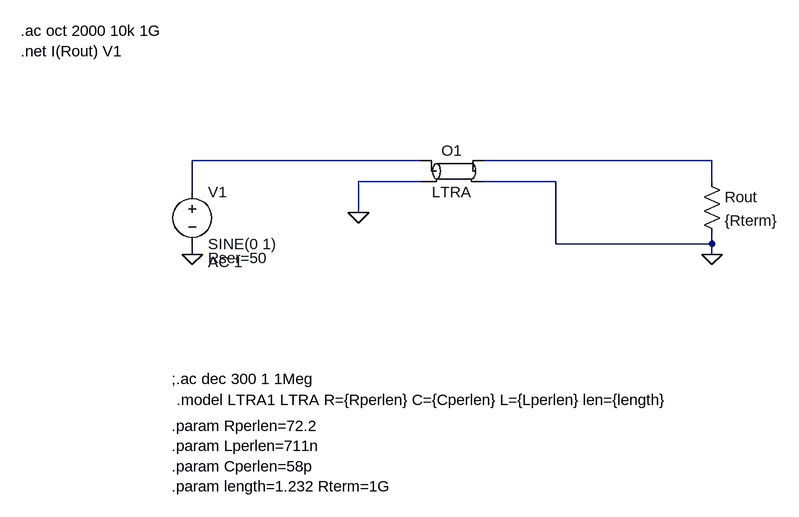
[diagram p0: schematic sparam_ltra_s11.asc]
sparam_ltra_s11.asc, the LTspice schematic file:
Version 4
SHEET 1 1668 680
WIRE -1168 80 -1520 80
WIRE -720 80 -1072 80
WIRE -1168 112 -1264 112
WIRE -960 112 -1072 112
WIRE -720 112 -720 80
WIRE -1520 128 -1520 80
WIRE -1264 160 -1264 112
WIRE -960 208 -960 112
WIRE -720 208 -720 192
WIRE -720 208 -960 208
WIRE -1520 224 -1520 208
WIRE -720 224 -720 208
FLAG -1520 224 0
FLAG -720 224 0
FLAG -1264 160 0
SYMBOL res -736 96 R0
SYMATTR InstName Rout
SYMATTR Value {Rterm}
SYMBOL voltage -1520 112 R0
WINDOW 39 24 118 Left 2
WINDOW 123 24 124 Left 2
SYMATTR SpiceLine Rser=50
SYMATTR Value2 AC 1
SYMATTR InstName V1
SYMATTR Value SINE(0 1)
SYMBOL ltline -1120 96 R0
SYMATTR InstName O1
SYMATTR SpiceModel LTRA1
TEXT -1552 416 Left 2 !;.ac dec 300 1 1Meg
TEXT -1544 448 Left 2 !.model LTRA1 LTRA R={Rperlen} C={Cperlen} L={Lperlen} len={length}
TEXT -1552 488 Left 2 !.param Rperlen=72.2\n.param Lperlen=711n\n.param Cperlen=58p\n.param length=1.232 Rterm=1G
TEXT -1784 -120 Left 2 !.ac oct 2000 10k 1G\n.net I(Rout) V1

The netlist it stands for:
* sparam_ltra_s11.asc
Rout N002 0 {Rterm}
V1 N001 0 SINE(0 1) AC 1 Rser=50
O1 N001 0 N002 0 LTRA1 LTRA
;.ac dec 300 1 1Meg
.model LTRA1 LTRA R={Rperlen} C={Cperlen} L={Lperlen} len={length}
.param Rperlen=72.2
.param Lperlen=711n
.param Cperlen=58p
.param length=1.232 Rterm=1G
.ac oct 2000 10k 1G
.net I(Rout) V1
.backanno
.end